# EAGLE design BLE_Test_Board (EAGLE 7.6.0)
AUTHOR: K. Townsend
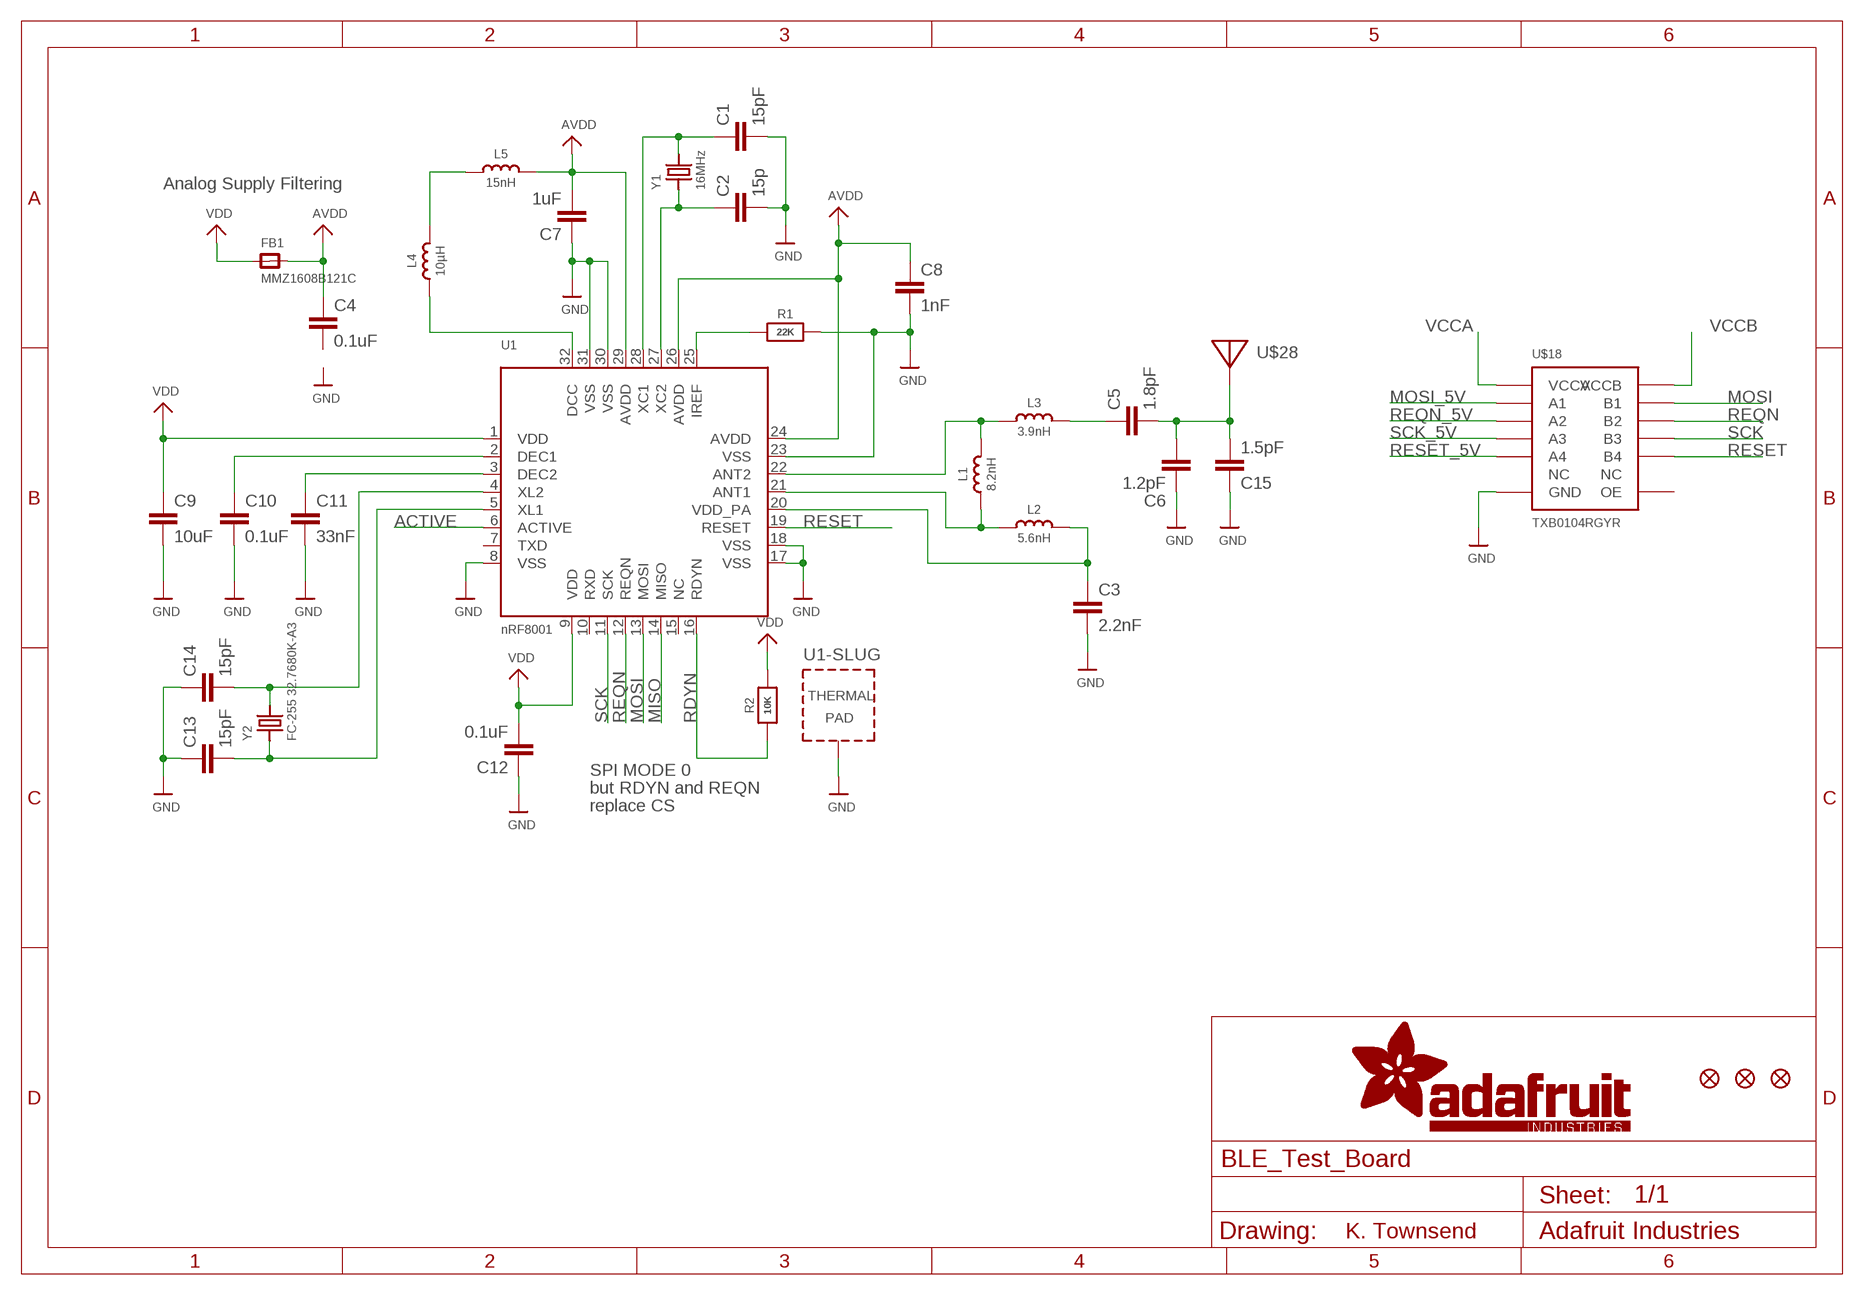
[diagram p0: schematic, sheet 1]

## Parts
C1  15pF  CAP0402-CAP  [0402-CAP]
C2  15p  CAP0402-CAP  [0402-CAP]
C3  2.2nF  CAP0402-CAP  [0402-CAP]
C4  0.1uF  CAP0402-CAP  [0402-CAP]
C5  1.8pF  CAP0402-CAP  [0402-CAP]
C6  1.2pF  CAP0402-CAP  [0402-CAP]
C7  1uF  CAP0402-CAP  [0402-CAP]
C8  1nF  CAP0402-CAP  [0402-CAP]
C9  10uF  CAP0402-CAP  [0402-CAP]
C10  0.1uF  CAP0402-CAP  [0402-CAP]
C11  33nF  CAP0402-CAP  [0402-CAP]
C12  0.1uF  CAP0402-CAP  [0402-CAP]
C13  15pF  CAP0402-CAP  [0402-CAP]
C14  15pF  CAP0402-CAP  [0402-CAP]
C15  1.5pF  CAP0402-CAP  [0402-CAP]
FB1  MMZ1608B121C  FERRITE0805  [0805]
FID1  FIDUCIAL""  [FIDUCIAL_1MM]
FID2  FIDUCIAL""  [FIDUCIAL_1MM]
FID3  FIDUCIAL""  [FIDUCIAL_1MM]
L1  8.2nH  INDUCTOR_0402  [_0402]
L2  5.6nH  INDUCTOR_0402  [_0402]
L3  3.9nH  INDUCTOR_0402  [_0402]
L4  10µH  INDUCTOR_0603  [_0603]
L5  15nH  INDUCTOR_0603  [_0603]
R1  22K  RESISTOR_0805MP  [_0805MP]
R2  10K  RESISTOR0805_NOOUTLINE  [0805-NO]
U1  nRF8001  NRF8001  [QFN32_5MM]
U$18  TXB0104RGYR  [14-VFQFN-EXPOSED-PAD]
U$28  ANTENNA_PCBNRF8001_1.6MM  [ANT_PCB_2.4GHZ_NRF8001_1.6MM_1OZ]
Y1  16MHz  CRYSTAL2.5X2.0  [CRYSTAL_2.5X2]
Y2  FC-255 32.7680K-A3  CRYSTAL4.9X1.8  [CRYSTAL_4.9X1.8]

## Nets
ACTIVE: U1.6(ACTIVE)
AVDD: C4.1 C7.2 C8.1 FB1.2 L5.2 U1.24(AVDD) U1.26(AVDD) U1.29(AVDD)
GND: C1.2 C2.2 C3.2 C6.1 C7.1 C8.2 C9.2 C10.2 C11.2 C12.1 C13.1 C14.1 C15.1 R1.2 U1.8(VSS) U1.17(VSS) U1.18(VSS) U1.23(VSS) U1.30(VSS) U1.31(VSS) U1.33(TP) U$18.P$7(GND)
MISO: U1.14(MISO)
MOSI: U1.13(MOSI) U$18.P$13(B1)
MOSI_5V: U$18.P$2(A1)
N$2: L1.2 L3.1 U1.22(ANT2)
N$3: L1.1 L2.1 U1.21(ANT1)
N$4: C3.1 L2.2 U1.20(VDD_PA)
N$5: L4.2 L5.1
N$6: C5.1 L3.2
N$7: C11.1 U1.3(DEC2)
N$8: C10.1 U1.2(DEC1)
N$9: C1.1 U1.28(XC1) Y1.3
N$10: C2.1 U1.27(XC2) Y1.1
N$11: L4.1 U1.32(DCC)
N$12: R1.1 U1.25(IREF)
N$13: C5.2 C6.2 C15.2 U$28.FEED
N$22: C14.2 U1.4(XL2) Y2.2
N$23: C13.2 U1.5(XL1) Y2.1
RDYN: R2.1 U1.16(RDYN)
REQN: U1.12(REQN) U$18.P$12(B2)
REQN_5V: U$18.P$3(A2)
RESET: U1.19(RESET) U$18.P$10(B4)
RESET_5V: U$18.P$5(A4)
SCK: U1.11(SCK) U$18.P$11(B3)
SCK_5V: U$18.P$4(A3)
VCCA: U$18.P$1(VCCA)
VCCB: U$18.P$14(VCCB)
VDD: C9.1 C12.2 FB1.1 R2.2 U1.1(VDD) U1.9(VDD)
Unconnected: C4.2 U1.7(TXD) U1.10(RXD) U1.15(NC) U$18.P$6(NC) U$18.P$8(OE) U$18.P$9(NC)

## Notes on the sheet
- Analog Supply Filtering
- SPI MODE 0
- but RDYN and REQN
- replace CS

## Library data of the parts
C1-C15 = SparkFun-Passives:CAP: Capacitor Standard 0603 ceramic capacitor, and 0.1" leaded capacitor.
FB1 = microbuilder:FERRITE: Ferrite Bead 0603 MMZ1608B121C - 120 Ohm @ 100MHz, 600mA, 0.15 Ohm DC Resistance - Digikey: 445-2164-1-ND BK1608HW121-T - 120 Ohm, 600mA Ferrite Chip - Digikey: 587-1876-2-ND 0805 HZ0805B272R-10 - 2.7K Ohm @ 100MHz, 200mA, 0.8 Ohm DC Resistance - Digikey: 240-2504-1-ND (see also Murata BLM21BD272SN1L) MMZ2012Y152B - 1.5K Ohm @ 100MHz, 500mA, 0.4 Ohm DC Resistance - Digikey: 445-1560-1-ND - Mainly for high frequency (80-400MHz) MMZ2012R102A - 1K Ohm @ 100MHz, 500mA, 0.3 Ohm DC Resistance - Digikey: 445-1555-2-ND - More general purpose (10-200MHz)
FID1-FID3 = microbuilder:FIDUCIAL: Fiducial Alignment Points Various fiducial points for machine vision alignment.; BOM: EXCLUDE
L1-L5 = microbuilder:INDUCTOR: Inductors 0603: 10nH Ceramic Inductor - microwire antenna/RF (Digikey: 712-1434-2-ND) 0805: 560nH Ceramic Inductor - RF (Digikey: 553-1047-1-ND) 270nH Ceramic Inductor - Q = 40@250MHz, +-5%, 1 Ohm DC Resistance (Digikey: 535-10506-2-ND) 1007 (2518 Metric) SMT: 10µH 10% 250mOhm 820mA 1007 Inductor (Digikey: 587-2189-1-ND) 22µH 10% 500mOhm 580mA 1007 Inductor (Digikey: 587-2190-1-ND) 47µH 10% 950mOhm 420mA 1007 Inductor (Digikey: 587-2191-1-ND) 47µH 5% 100mOhm 1A 1008 Inductor (Digikey: 732-1816-1-ND) 5.0x5.0mm (Taiyo Yuden NR5040 Series) 6.8µH 20% 2.3A 64mOhm Inductor (Digikey: 587-2374-2-ND) 5.0x5.0mm (TDK VLC5045 Series) 4.7µH 20% 3.3A 34mOhm Inductor (Digikey: 445-6526-1-ND) 6.8µH 20% 2.7A 46mOhm Inductor (Digikey: 445-6527-1-ND) 6.0x6.0mm (TDK VLC6045 Series) 4.7µH 20% 3.8A 27mOhm Inductor (Digikey: 445-6538-2-ND) 6.8µH 20% 3A 41mOhm Inductor (Digikey: 445-6540-1-ND) 6.2µH 30% 2.2A 45mOhm Inductor (Digikey: SRR5028-6R2YCT-ND) - Not TDK VLC6045 but footprint should match 6.0x6.0mm (TDK SLF6045 Series) 6.8uH 30% 2A 33mOhm Inductor (Digikey: 445-4572-1-ND, Mouser: 810-SLF645T6R8N2R0PF) 6.0x6.0mm (Sumida CDRH5D28 Series) 6.2uH 30% 1.8A 45mOhm Inductor (Digikey: 308-1542-1-ND) Taiyo Yuden NR3015T2R2M - 2.2uH 20% 1.5A (Digikey: 587-1648-2-ND, Mouser: 963-NR3015T2R2M) - Used with TI TPS62172 CoilCraft RFID Transponder Coil - MA5532-AE (For use with AS3935 Lightning Sensor)
R1 R2 = microbuilder:RESISTOR: Resistors For new designs, use the packages preceded by an '_' character since they are more reliable: The following footprints should be used on most boards: _0402 - Standard footprint for regular board layouts _0603 - Standard footprint for regular board layouts _0805 - Standard footprint for regular board layouts _1206 - Standard footprint for regular board layouts For extremely tight-pitch boards where space is at a premium, the following 'micro-pitch' footprints can be used (smaller pads, no silkscreen outline, etc.): _0402MP - Micro-pitch footprint for very dense/compact boards _0603MP - Micro-pitch footprint for very dense/compact boards _0805MP - Micro-pitch footprint for very dense/compact boards _1206MP - Micro-pitch footprint for very dense/compact boards
U1 = microbuilder:NRF8001: nRF8001 - Bluetooth Low-Energy Transceiver VDD: 1.9-3.6V Temp: -40°C - 85°C
U$18 = dynamicperception:TXB0104RGYR
U$28 = microbuilder:ANTENNA_PCB: Various pre-calculated PCB Antennas NRF8001 1.6mm 1Oz - 2.4GHz PCB antenna for 1.6mm PCBs with 1oz copper, double-sided boards (no GND plan beneath antenna). See nRF2740 production files for further information and impedance matching network. 868MHz/2.4GHz DUALBAND - Dual 868MHz and 2.4GHz centered antenna based on board #6 of the CC-ANTENNA-DK from Chipcon/TI
Y1 Y2 = microbuilder:CRYSTAL: Crystals HC49UP - Surface Mount Crystal 4.0MHz 18pF +/-30ppm Surface Mount Crystal [Digikey: 535-9857-1-ND] 12.0 MHz Surface Mount Crystal [Digikey: 535-9869-6-ND] 25.0 MHz Surface Mount Crystal [Digikey: 535-9078-1-ND] 2.5 x 2.0mm - MEMs SMT Crystal 16.0 MHz 10pF 20ppm 2.5 x 2.0mm Crystal [Digikey -40-85°C: 535-10923-1-ND] 3.2 x 2.5mm - MEMs SMT Crystal 12.0 MHz 8pF 15ppm 3.2 x 2.5mm Crystal [Digikey: -10-70°C: 644-1047-1-ND -40-125°C: 644-1128-1-ND] 40~85°C cheaper: 644-1173-6-ND 16.0 MHz 8pF 15ppm 3.2 x 2.5mm Crystal [Digikey: -10-70°C: 644-1049-1-ND -40-125°C: 644-1129-2-ND]-40~85°C cheaper: 644-1175-6-ND 16.0 MHz 10pF 10ppm 3.2 x 2.5mm Crystal [Digikey: 644-1100-1-ND] 27.12 MHz 18pF 30ppm 3.2 x 2.5mm Crystal [Digikey: 887-1424-1-ND] 27.12MHz 10pF 10ppm 3.2 x 2.5mm Crystal [Digikey: 887-1329-1-ND] 4.9 x 1.8mm - MEMs SMT Crystal 32.768 KHz 12.5pF 20ppm 4.9 x 1.8mm Crystal [Digikey: SE2415CT-ND] 8.0 x 3.8mm - Surface Mount Crystal 32.768kHz 12.5pF 20ppm -40°C-85°C [Digikey: 535-9166-2-ND] Cylinder 32.768KHz Cylinder Crystal (2x6mm body) [Ex. Digikey: 300-8341-2-ND]

## Board
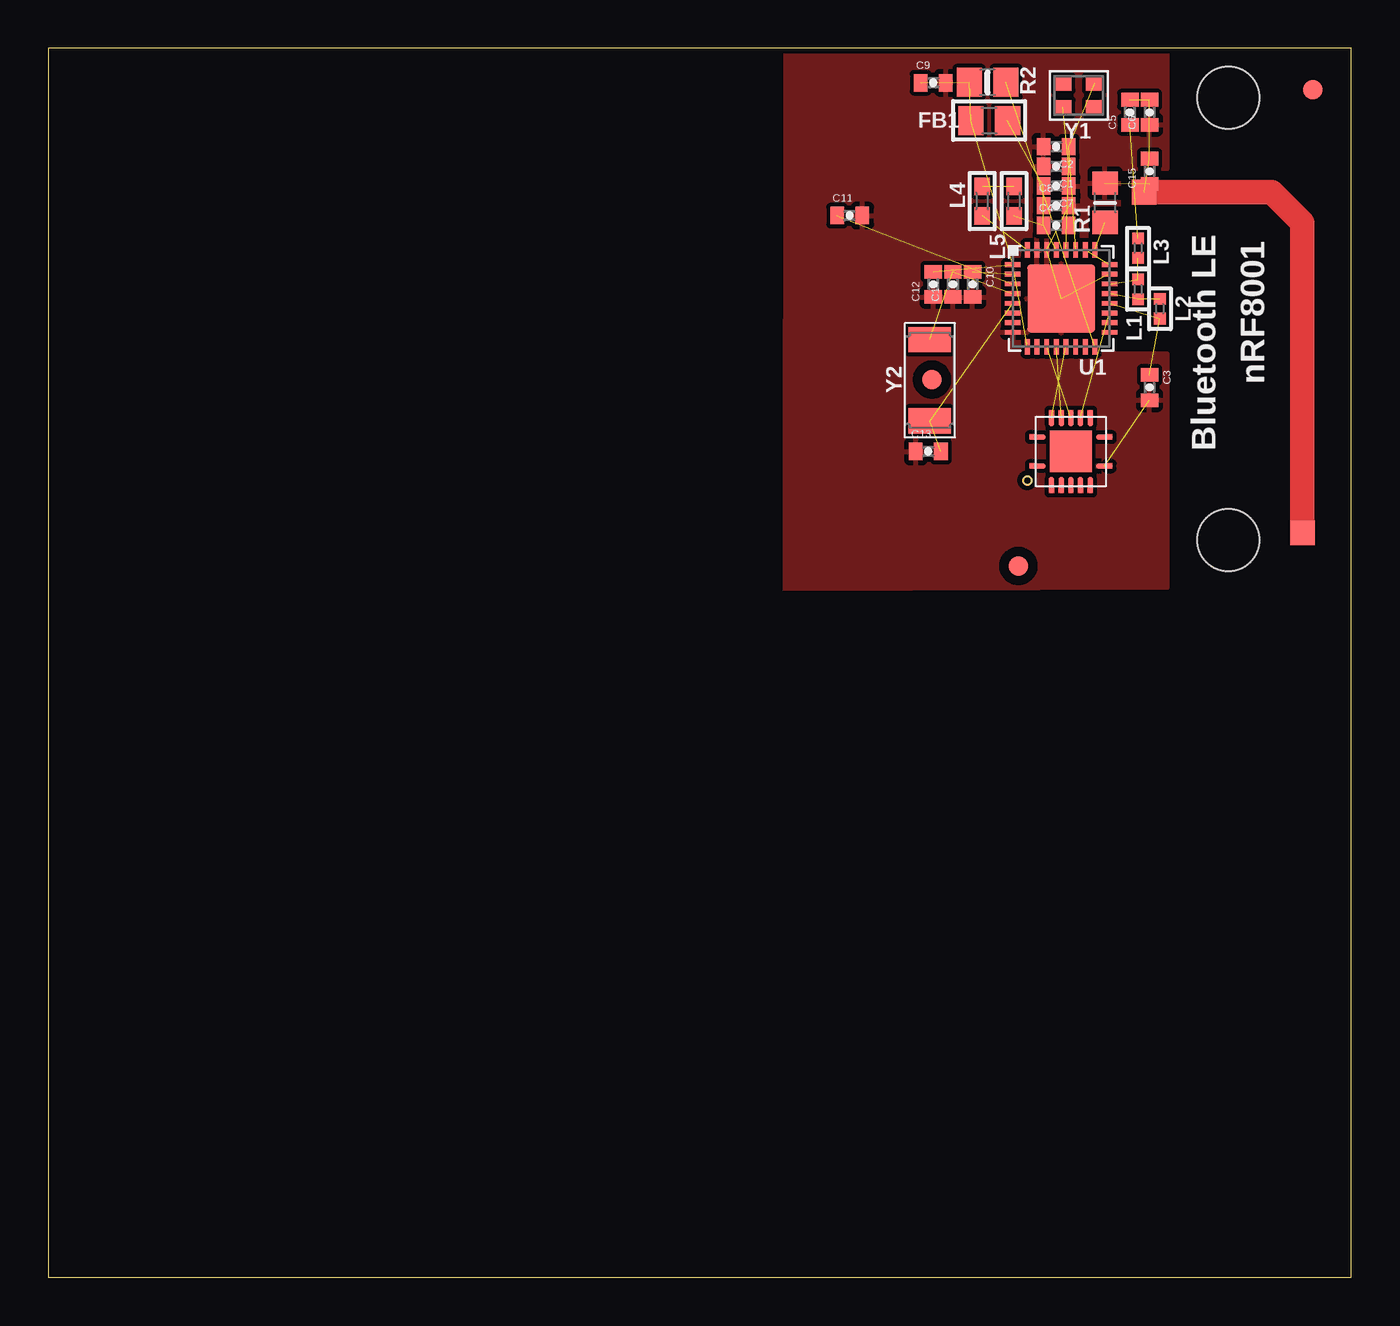
[diagram p1: board, top side]
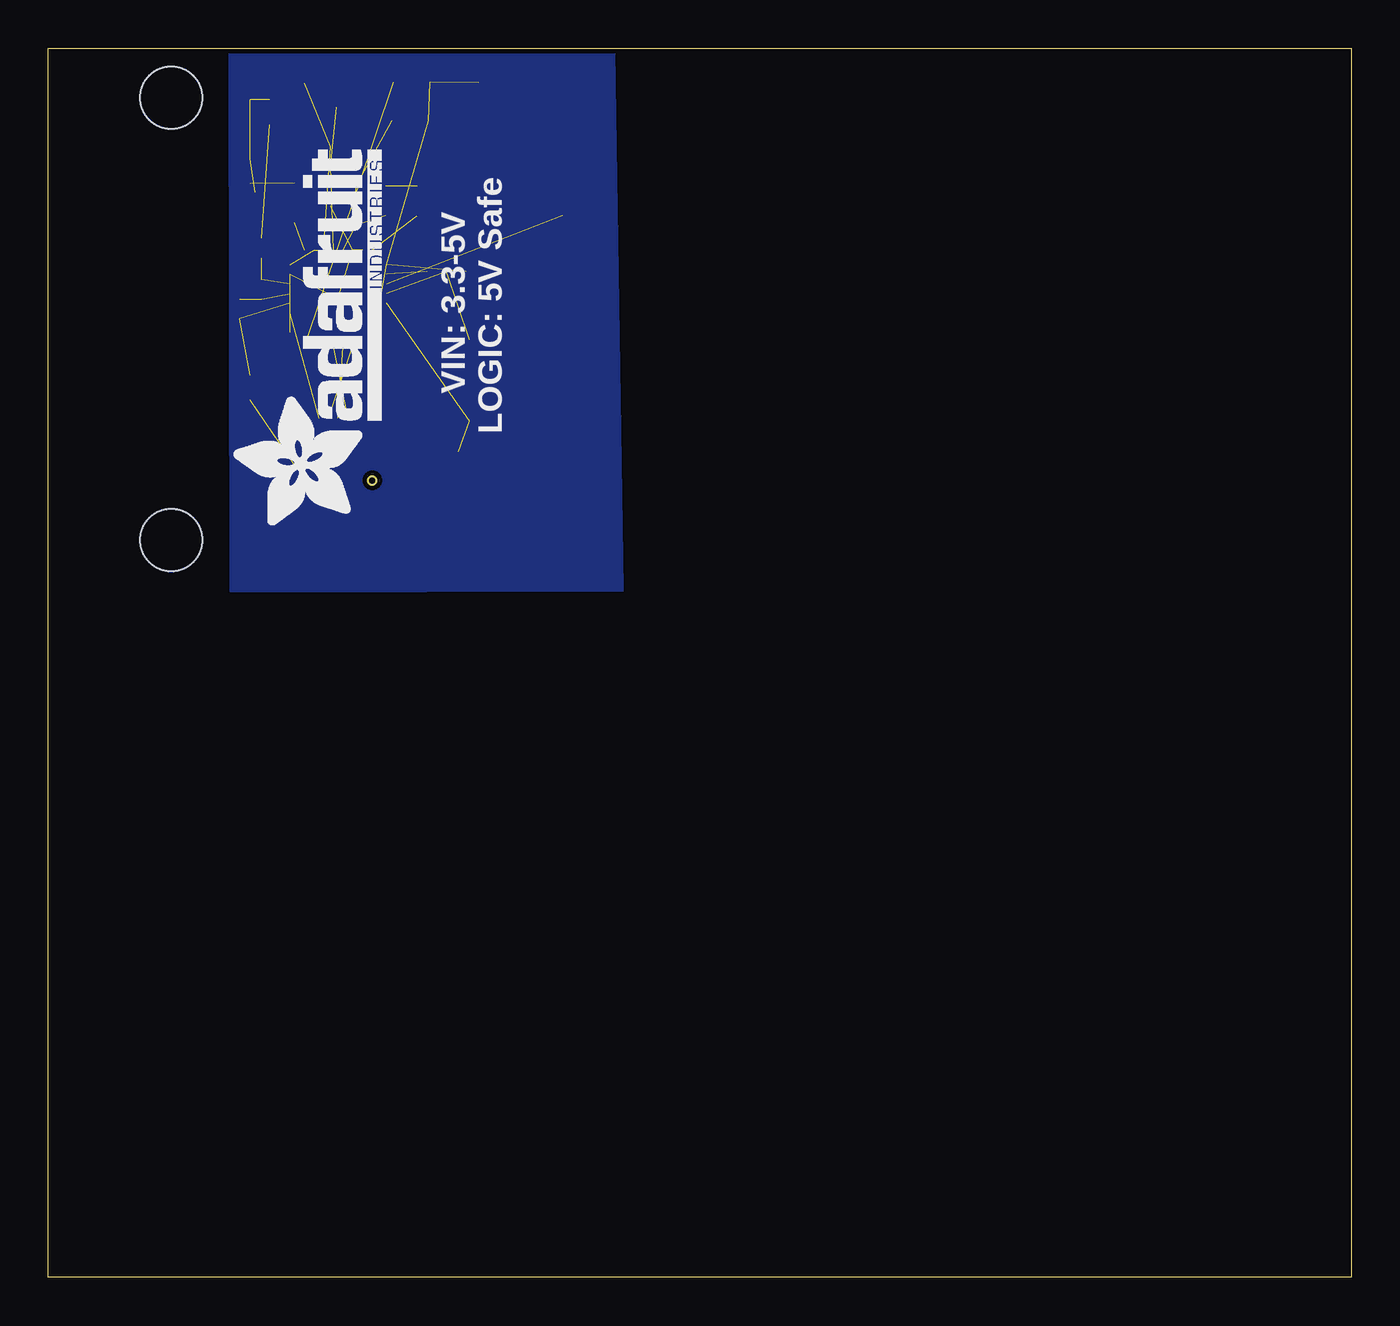
[diagram p2: board, bottom side, seen from below]

Size 67.31 x 63.5 mm. Coordinates in mm from the lower left corner, seen from the top.
Outline: 0,0 67.31,0 67.31,63.5 0,63.5 0,0
Copper layers (1*16): Top 0.035mm / dielectric 1.5mm / Bottom 0.035mm
Design rules "adafruit *": minimum track width 8mil, minimum drill 15.5mil, track to track 8mil, track to pad 8mil, pad to pad 8mil, via to via 8mil, smd to smd 8mil, copper to edge 10mil, drill to drill 8mil, minimum pad ring 10mil, minimum via ring 8mil, stop-mask expansion 4mil, vias tented up to drill 20mil, thermal gap 10mil
Holes 3.2 mm at 60.96,60.96 60.96,38.1
tRestrict: area 51.3,52.9 to 51.4,53.2

### Footprints (pad centres in the part's own frame; a part is rotated, then mirrored left to right if it is on the bottom)
0402-CAP = smd 0.7 x 0.9: 1 -0.65,0; 2 0.65,0
0805 = smd 1.3 x 1.5: 1 -0.95,0; 2 0.95,0
FIDUCIAL_1MM = smd 1 x 1: 1 0,0
_0402 = smd 0.6 x 0.6: 1 -0.508,0; 2 0.508,0
_0603 = smd 0.9 x 0.8: 1 -0.762,0; 2 0.762,0
_0805MP = smd 1.2 x 1.3: 1 -1.016,0; 2 1.016,0
0805-NO = smd 1.3 x 1.5: 1 -0.95,0; 2 0.95,0
QFN32_5MM = smd 0.8 x 0.25: 1 -2.5,1.75; 2 -2.5,1.25; 3 -2.5,0.75; 4 -2.5,0.25; 5 -2.5,-0.25; 6 -2.5,-0.75; 7 -2.5,-1.25; 8 -2.5,-1.75; 17 2.5,-1.75; 18 2.5,-1.25; 19 2.5,-0.75; 20 2.5,-0.25; 21 2.5,0.25; 22 2.5,0.75; 23 2.5,1.25; 24 2.5,1.75 | smd 0.25 x 0.8: 9 -1.75,-2.5; 10 -1.25,-2.5; 11 -0.75,-2.5; 12 -0.25,-2.5; 13 0.25,-2.5; 14 0.75,-2.5; 15 1.25,-2.5; 16 1.75,-2.5; 25 1.75,2.5; 26 1.25,2.5; 27 0.75,2.5; 28 0.25,2.5; 29 -0.25,2.5; 30 -0.75,2.5; 31 -1.25,2.5; 32 -1.75,2.5 | smd 3.5 x 3.5: 33 0,0
14-VFQFN-EXPOSED-PAD = smd 0.85 x 0.28: P$1 -1.725,-0.75; P$7 1.725,-0.75; P$8 1.725,0.75; P$14 -1.725,0.75 | smd 0.28 x 0.85: P$2 -1,-1.725; P$3 -0.5,-1.725; P$4 0,-1.725; P$5 0.5,-1.725; P$6 1,-1.725; P$9 1,1.725; P$10 0.5,1.725; P$11 0,1.725; P$12 -0.5,1.725; P$13 -1,1.725 | smd 2.15 x 2.15: P$1111 0,0
ANT_PCB_2.4GHZ_NRF8001_1.6MM_1OZ = smd 1.27 x 1.27: FEED 0,0; TESTPOINT -8.169,17.605
CRYSTAL_2.5X2 = smd 0.9 x 0.75: 1 -0.825,-0.625; 2 0.825,-0.625; 3 0.825,0.625; 4 -0.825,0.625
CRYSTAL_4.9X1.8 = smd 1.3 x 2.2: 1 -2.1,0; 2 2.1,0

### Placement (x,y rotation side)
C1  52.07,57.4 180 top
C2  52.07,58.42 180 top
C3  56.9,45.97 270 top
C4  52.07,54.36 0 top
C5  55.88,60.2 90 top
C6  56.9,60.2 90 top
C7  52.07,56.39 180 top
C8  52.07,55.37 0 top
C9  45.72,61.72 0 top
C10  47.75,51.31 270 top
C11  41.4,54.86 0 top
C12  45.72,51.31 90 top
C13  45.47,42.67 0 top
C14  46.74,51.31 90 top
C15  56.9,57.15 90 top
FB1  48.61,59.77 0 top
FID1  45.65,46.39 180 top
FID2  50.12,36.76 180 top
FID3  65.34,61.37 180 top
L1  56.3,51.05 90 top
L2  57.43,50.05 270 top
L3  56.3,53.17 90 top
L4  48.25,55.61 90 top
L5  49.89,55.61 270 top
R1  54.59,55.52 90 top
R2  48.53,61.74 180 top
U1  52.33,50.58 0 top
U$18  52.83,42.67 0 top
U$22  [ADAFRUIT_TEXT_20MM]  50.11,38.7 90 bottom
U$28  56.62,56.07 180 top
Y1  53.23,61.07 180 top
Y2  45.54,46.35 90 top

### Tracks (layer width: path | path; a pad name or v marks a point on that pad's centre or on a via)
AVDD  (7 unrouted)
GND  (8 unrouted)
  pour Bottom: 57.91,63.33 57.87,35.48 37.67,35.53 38.1,63.34
  pour Top: 53.8,47.75 57.8,47.75 57.8,35.61 38.05,35.53 38.07,63.5 57.8,63.5 57.8,57.25 55.3,57.25 55.3,53.25 53.8,53.25
MOSI  (1 unrouted)
N$2  (2 unrouted)
N$3  (2 unrouted)
N$4  (2 unrouted)
N$5  (1 unrouted)
N$6  (1 unrouted)
N$7  (1 unrouted)
N$8  (1 unrouted)
N$9  (2 unrouted)
N$10  (2 unrouted)
N$11  (1 unrouted)
N$12  (1 unrouted)
N$13  (3 unrouted)
N$22  (2 unrouted)
N$23  (2 unrouted)
RDYN  (1 unrouted)
REQN  (1 unrouted)
RESET  (1 unrouted)
SCK  (1 unrouted)
VDD  (5 unrouted)

### Text on the board
tPlace: Bluetooth LE | nRF8001
bPlace: LOGIC: 5V Safe | VIN: 3.3-5V